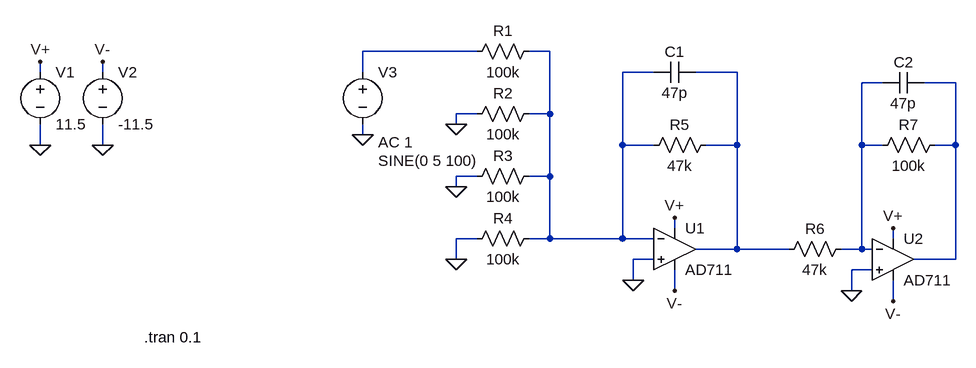
[diagram p0: schematic mixer.asc]
mixer.asc, the LTspice schematic file:
Version 4
SHEET 1 880 680
WIRE -32 -64 -208 -64
WIRE 80 -64 48 -64
WIRE -704 -32 -704 -48
WIRE -608 -32 -608 -48
WIRE -208 -32 -208 -64
WIRE 240 -32 192 -32
WIRE 368 -32 304 -32
WIRE 592 -16 560 -16
WIRE 704 -16 656 -16
WIRE -32 32 -64 32
WIRE 80 32 80 -64
WIRE 80 32 48 32
WIRE -64 48 -64 32
WIRE -208 64 -208 48
WIRE -704 80 -704 48
WIRE -608 80 -608 48
WIRE 192 80 192 -32
WIRE 240 80 192 80
WIRE 368 80 368 -32
WIRE 368 80 320 80
WIRE 560 80 560 -16
WIRE 592 80 560 80
WIRE 704 80 704 -16
WIRE 704 80 672 80
WIRE -32 128 -64 128
WIRE 80 128 80 32
WIRE 80 128 48 128
WIRE -64 144 -64 128
WIRE 272 208 272 192
WIRE -32 224 -64 224
WIRE 80 224 80 128
WIRE 80 224 48 224
WIRE 192 224 192 80
WIRE 192 224 80 224
WIRE 240 224 192 224
WIRE 608 224 608 208
WIRE 368 240 368 80
WIRE 368 240 304 240
WIRE 448 240 368 240
WIRE 560 240 560 80
WIRE 560 240 528 240
WIRE 576 240 560 240
WIRE -64 256 -64 224
WIRE 240 256 208 256
WIRE 704 256 704 80
WIRE 704 256 640 256
WIRE 576 272 544 272
WIRE 208 288 208 256
WIRE 272 304 272 272
WIRE 544 304 544 272
WIRE 608 320 608 288
FLAG -704 80 0
FLAG -608 80 0
FLAG -704 -48 V+
FLAG -608 -48 V-
FLAG 272 192 V+
FLAG 272 304 V-
FLAG 208 288 0
FLAG -64 256 0
FLAG -64 144 0
FLAG -64 48 0
FLAG -208 64 0
FLAG 608 208 V+
FLAG 608 320 V-
FLAG 544 304 0
SYMBOL res 64 -80 R90
WINDOW 0 0 56 VBottom 2
WINDOW 3 32 56 VTop 2
SYMATTR InstName R1
SYMATTR Value 100k
SYMBOL OpAmps\\AD711 272 176 R0
SYMATTR InstName U1
SYMBOL voltage -704 -48 R0
WINDOW 123 0 0 Left 0
WINDOW 39 0 0 Left 0
SYMATTR InstName V1
SYMATTR Value 11.5
SYMBOL voltage -608 -48 R0
WINDOW 123 0 0 Left 0
WINDOW 39 0 0 Left 0
SYMATTR InstName V2
SYMATTR Value -11.5
SYMBOL res 64 16 R90
WINDOW 0 0 56 VBottom 2
WINDOW 3 32 56 VTop 2
SYMATTR InstName R2
SYMATTR Value 100k
SYMBOL res 64 112 R90
WINDOW 0 0 56 VBottom 2
WINDOW 3 32 56 VTop 2
SYMATTR InstName R3
SYMATTR Value 100k
SYMBOL res 64 208 R90
WINDOW 0 0 56 VBottom 2
WINDOW 3 32 56 VTop 2
SYMATTR InstName R4
SYMATTR Value 100k
SYMBOL res 336 64 R90
WINDOW 0 0 56 VBottom 2
WINDOW 3 32 56 VTop 2
SYMATTR InstName R5
SYMATTR Value 47k
SYMBOL voltage -208 -48 R0
WINDOW 123 24 124 Left 2
WINDOW 39 0 0 Left 0
WINDOW 3 24 152 Left 2
SYMATTR Value2 AC 1
SYMATTR InstName V3
SYMATTR Value SINE(0 5 100)
SYMBOL cap 304 -48 R90
WINDOW 0 0 32 VBottom 2
WINDOW 3 32 32 VTop 2
SYMATTR InstName C1
SYMATTR Value 47p
SYMBOL OpAmps\\AD711 608 192 R0
SYMATTR InstName U2
SYMBOL res 544 224 R90
WINDOW 0 0 56 VBottom 2
WINDOW 3 32 56 VTop 2
SYMATTR InstName R6
SYMATTR Value 47k
SYMBOL res 688 64 R90
WINDOW 0 0 56 VBottom 2
WINDOW 3 32 56 VTop 2
SYMATTR InstName R7
SYMATTR Value 100k
SYMBOL cap 656 -32 R90
WINDOW 0 0 32 VBottom 2
WINDOW 3 32 32 VTop 2
SYMATTR InstName C2
SYMATTR Value 47p
TEXT -544 376 Left 2 !.tran 0.1

The netlist it stands for:
* mixer.asc
R1 N002 N001 100k
XU1 0 N002 V+ V- N003 AD712  ; AD711, pins In+ In- V+ V- OUT
V1 V+ 0 11.5
V2 V- 0 -11.5
R2 N002 0 100k
R3 N002 0 100k
R4 N002 0 100k
R5 N003 N002 47k
V3 N001 0 SINE(0 5 100) AC 1
C1 N003 N002 47p
XU2 0 N004 V+ V- N005 AD712  ; AD711, pins In+ In- V+ V- OUT
R6 N004 N003 47k
R7 N005 N004 100k
C2 N005 N004 47p
.tran 0.1
.lib ADI1.lib
.backanno
.end